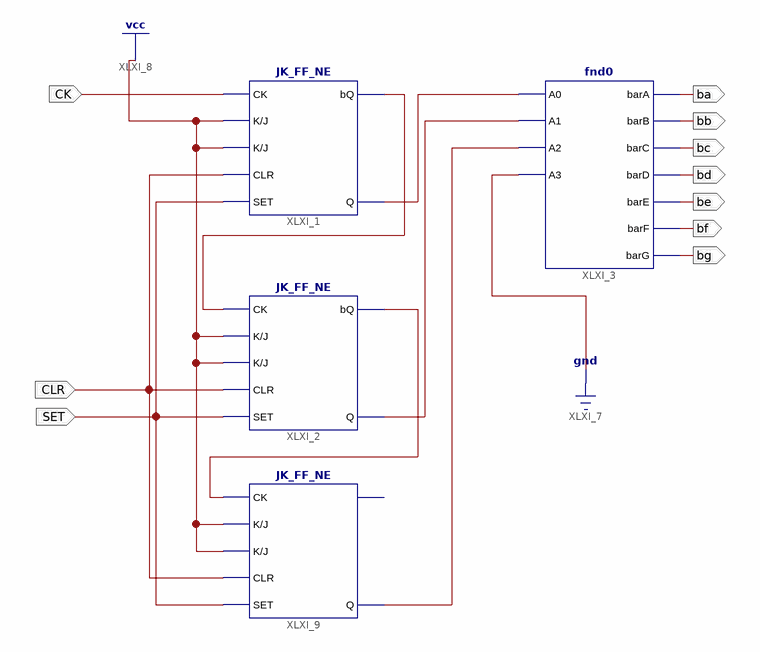
[diagram p0: schematic sheet 1]
// Xilinx ISE schematic Mod4_A.sch (spartan6) as structural Verilog: 4 symbols, 10 ports
module Mod4_A (
  input  SET,
  input  CLR,
  input  CK,
  output ba,
  output bb,
  output bc,
  output bd,
  output be,
  output bf,
  output bg
);

  wire Q1, XLXN_21, XLXN_22, XLXN_23, XLXN_25;

  JK_FF_NE XLXI_1 (.CK(CK), .K(1'b1), .J(1'b1), .CLR(CLR), .SET(SET), .bQ(XLXN_21), .Q(XLXN_22));
  fnd0 XLXI_3 (
    .A0(XLXN_22), .A1(Q1), .A2(XLXN_25), .A3(1'b0), .barA(ba), .barB(bb), .barC(bc), .barD(bd), .barE(be),
    .barF(bf), .barG(bg));
  JK_FF_NE XLXI_2 (.CK(XLXN_21), .K(1'b1), .J(1'b1), .CLR(CLR), .SET(SET), .bQ(XLXN_23), .Q(Q1));
  JK_FF_NE XLXI_9 (.CK(XLXN_23), .K(1'b1), .J(1'b1), .CLR(CLR), .SET(SET), .Q(XLXN_25));  // open: bQ
endmodule
